# EAGLE design dtmf_v1 (EAGLE 9.6.2)
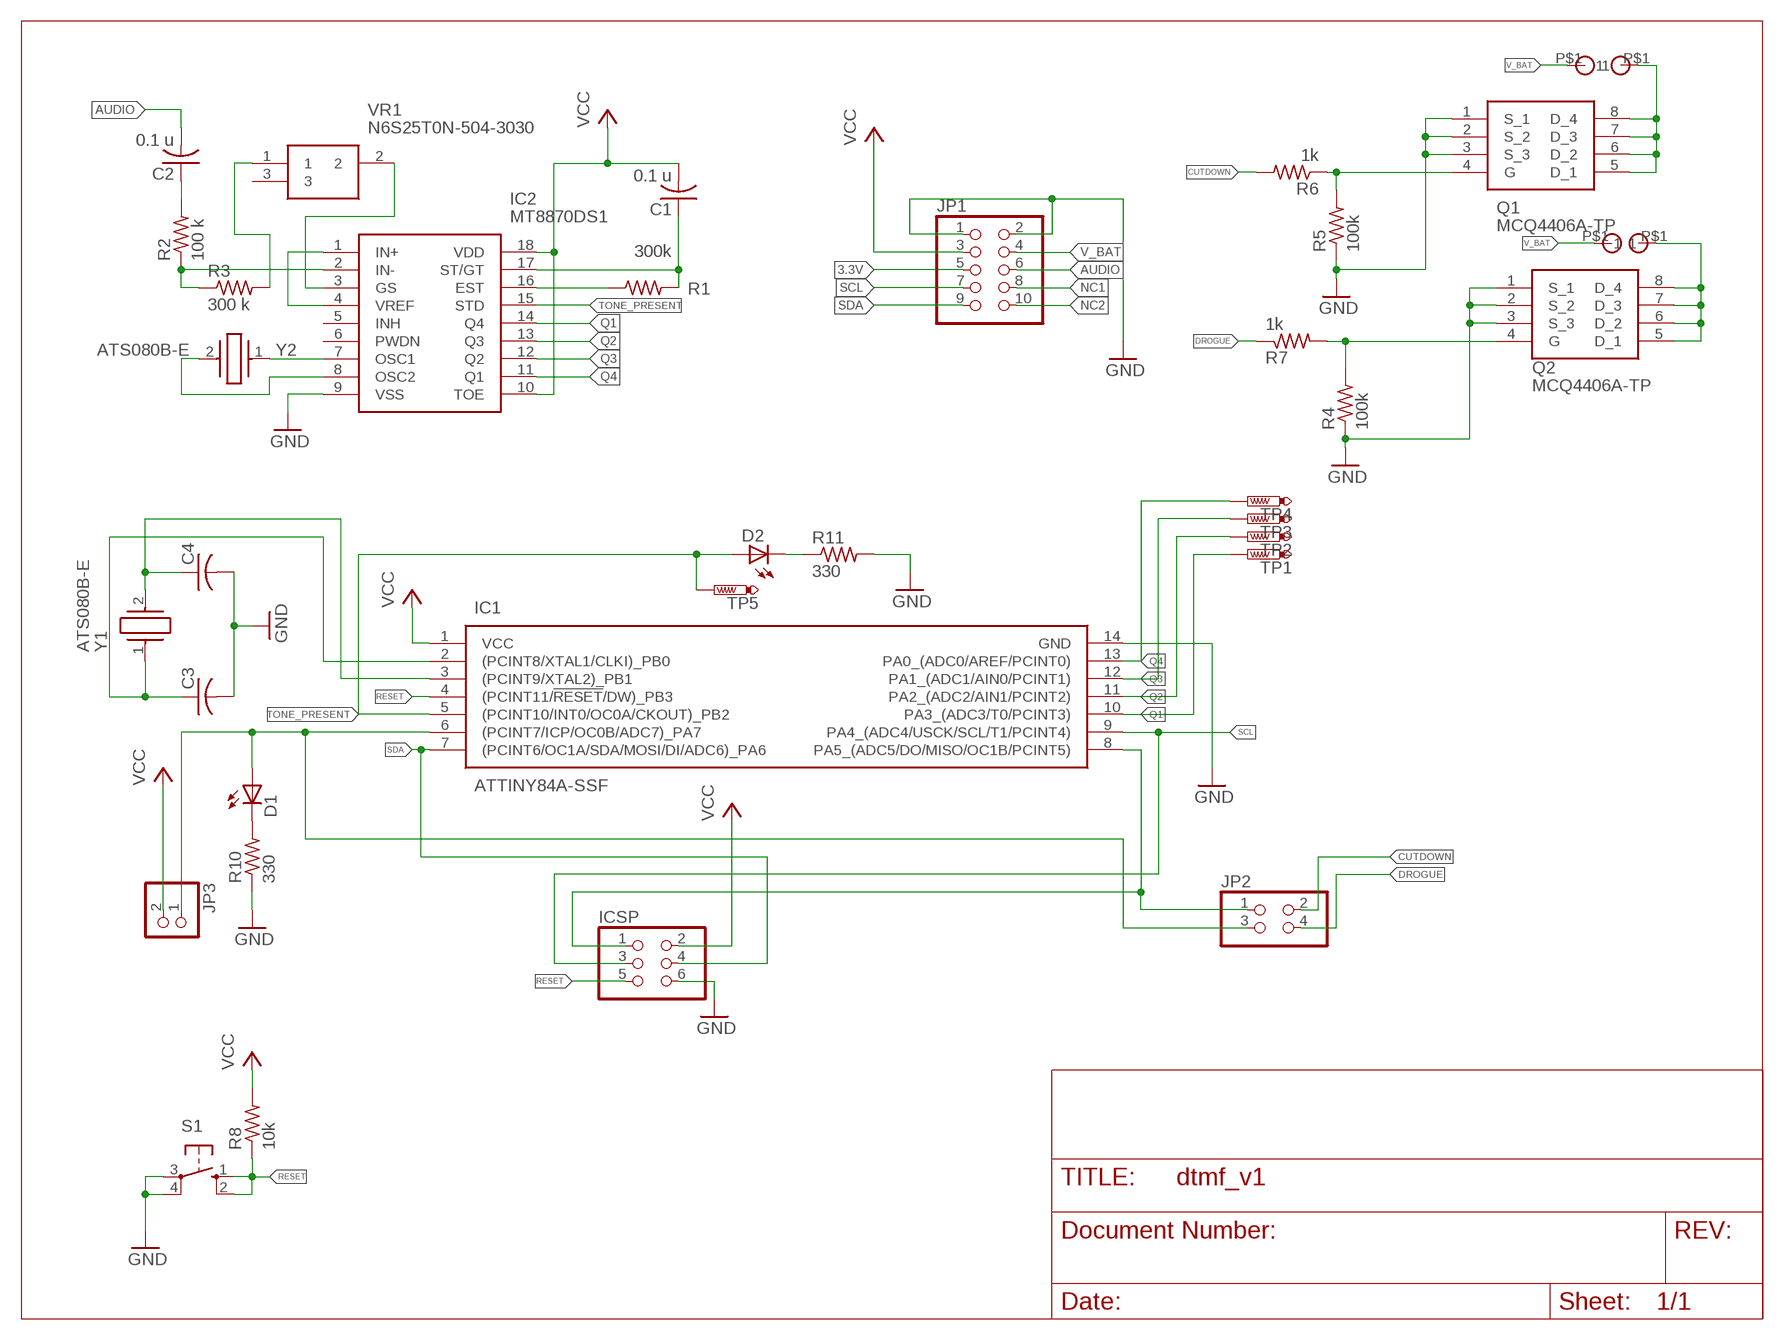
[diagram p0: schematic, sheet 1]

## Parts
C1  0.1 u  C-USC0603  [C0603]
C2  0.1 u  C-USC0603  [C0603]
C3  C-USC0805  [C0805]
C4  C-USC0805  [C0805]
D1  LEDCHIP-LED0805  [CHIP-LED0805]
D2  LEDCHIP-LED0805  [CHIP-LED0805]
IC1  ATTINY84A-SSF  [SOIC127P600X175-14N]
IC2  MT8870DS1  [SOIC127P1032X265-18N]
ICSP  PINHD-2X3  [2X03]
JP1  PINHD-2X5  [2X05]
JP2  PINHD-2X2  [2X02]
JP3  PINHD-1X2  [1X02]
Q1  MCQ4406A-TP  [SOIC127P600X175-8N]
Q2  MCQ4406A-TP  [SOIC127P600X175-8N]
R1  300k  R-US_M0805  [M0805]
R2  100 k  R-US_M0805  [M0805]
R3  300 k  R-US_M0805  [M0805]
R4  100k  R-US_M0805  [M0805]
R5  100k  R-US_M0805  [M0805]
R6  1k  R-US_M0805  [M0805]
R7  1k  R-US_M0805  [M0805]
R8  10k  R-US_0207/10  [0207/10]
R10  330  R-US_M0805  [M0805]
R11  330  R-US_M0805  [M0805]
S1  10-XX  [B3F-10XX]
TP1  PTR1B1,27  [B1,27]
TP2  PTR1B1,27  [B1,27]
TP3  PTR1B1,27  [B1,27]
TP4  PTR1B1,27  [B1,27]
TP5  PTR1B1,27  [B1,27]
U$1  M3_HOLE  [MOUNTING_PAD]
U$2  M3_HOLE  [MOUNTING_PAD]
U$3  M3_HOLE  [MOUNTING_PAD]
U$4  M3_HOLE  [MOUNTING_PAD]
VR1  N6S25T0N-504-3030  [N6S25T0N5043030]
Y1  ATS080B-E  [ATS080BE]
Y2  ATS080B-E  [ATS080BE]

## Nets
3.3V: JP1.5
AUDIO: C2.2 JP1.6
CUTDOWN: JP2.2 R6.2
DROGUE: JP2.4 R7.1
GND [PWR]: C3.2 C4.2 IC1.14(GND) IC2.9(VSS) ICSP.6 JP1.1 JP1.2 Q1.1(S_1) Q1.2(S_2) Q1.3(S_3) Q2.1(S_1) Q2.2(S_2) Q2.3(S_3) R4.1 R5.1 R10.1 R11.2 S1.3(P) S1.4(P1)
N$1: IC2.7(OSC1) Y2.1
N$2: IC2.8(OSC2) Y2.2
N$3: IC2.1(IN+) IC2.4(VREF)
N$6: Q1.4(G) R5.2 R6.1
N$9: C3.1 IC1.2((PCINT8/XTAL1/CLKI)_PB0) Y1.1
N$10: C4.1 IC1.3((PCINT9/XTAL2)_PB1) Y1.2
N$11: C1.1 IC2.17(ST/GT) R1.2
N$12: IC2.16(EST) R1.1
N$13: R3.2 VR1.1
N$14: IC2.2(IN-) R2.1 R3.1
N$15: C2.1 R2.2
N$16: IC2.3(GS) VR1.2
N$17 [PWR]: Q2.5(D_1) Q2.6(D_2) Q2.7(D_3) Q2.8(D_4) U$4.P$1
N$20 [PWR]: Q1.5(D_1) Q1.6(D_2) Q1.7(D_3) Q1.8(D_4) U$2.P$1
N$22: D1.A IC1.6((PCINT7/ICP/OC0B/ADC7)_PA7) JP2.3 JP3.1
N$23: D1.C R10.2
N$24: IC1.8(PA5_(ADC5/DO/MISO/OC1B/PCINT5)) ICSP.1 JP2.1
N$25: D2.C R11.1
N$27: Q2.4(G) R4.2 R7.2
NC1: JP1.8
NC2: JP1.10
Q1: IC1.10(PA3_(ADC3/T0/PCINT3)) IC2.14(Q4) TP1.TP
Q2: IC1.11(PA2_(ADC2/AIN1/PCINT2)) IC2.13(Q3) TP2.TP
Q3: IC1.12(PA1_(ADC1/AIN0/PCINT1)) IC2.12(Q2) TP3.TP
Q4: IC1.13(PA0_(ADC0/AREF/PCINT0)) IC2.11(Q1) TP4.TP
RESET: IC1.4((PCINT11/!RESET!/DW)_PB3) ICSP.5 R8.1 S1.1(S) S1.2(S1)
SCL: IC1.9(PA4_(ADC4/USCK/SCL/T1/PCINT4)) ICSP.3 JP1.7
SDA: IC1.7((PCINT6/OC1A/SDA/MOSI/DI/ADC6)_PA6) ICSP.4 JP1.9
TONE_PRESENT: D2.A IC1.5((PCINT10/INT0/OC0A/CKOUT)_PB2) IC2.15(STD) TP5.TP
V_BAT [PWR]: JP1.4 U$1.P$1 U$3.P$1
VCC: C1.2 IC1.1(VCC) IC2.10(TOE) IC2.18(VDD) ICSP.2 JP1.3 JP3.2 R8.2
Unconnected: IC2.5(INH) IC2.6(PWDN) VR1.3

## Library data of the parts
C1-C4 = rcl:C-US: CAPACITOR, American symbol; SPICEPREFIX: C
D1 D2 = adafruit:LED: LED OSRAM: - CHIPLED LG R971, LG N971, LY N971, LG Q971, LY Q971, LO R971, LY R971 LH N974, LH R974 LS Q976, LO Q976, LY Q976 LO Q996 - Hyper CHIPLED LW Q18S LB Q993, LB Q99A, LB R99A - SideLED LS A670, LO A670, LY A670, LG A670, LP A670 LB A673, LV A673, LT A673, LW A673 LH A674 LY A675 LS A676, LA A676, LO A676, LY A676, LW A676 LS A679, LY A679, LG A679 - Hyper Micro SIDELED® LS Y876, LA Y876, LO Y876, LY Y876 LT Y87S - SmartLED LW L88C, LW L88S LB L89C, LB L89S, LG L890 LS L89K, LO L89K, LY L89K LS L896, LA L896, LO L896, LY L896 - TOPLED LS T670, LO T670, LY T670, LG T670, LP T670 LSG T670, LSP T670, LSY T670, LOP T670, LYG T670 LG T671, LOG T671, LSG T671 LB T673, LV T673, LT T673, LW T673 LH T674 LS T676, LA T676, LO T676, LY T676, LB T676, LH T676, LSB T676, LW T676 LB T67C, LV T67C, LT T67C, LS T67K, LO T67K, LY T67K, LW E67C LS E67B, LA E67B, LO E67B, LY E67B, LB E67C, LV E67C, LT E67C LW T67C LS T679, LY T679, LG T679 LS T770, LO T770, LY T770, LG T770, LP T770 LB T773, LV T773, LT T773, LW T773 LH T774 LS E675, LA E675, LY E675, LS T675 LS T776, LA T776, LO T776, LY T776, LB T776 LHGB T686 LT T68C, LB T68C - Hyper Mini TOPLED® LB M676 - Mini TOPLED Santana® LG M470 LS M47K, LO M47K, LY M47K Source: http://www.osram.convergy.de/
IC1 = ATTINY84A-SSF:ATTINY84A-SSF: Atmel ATTINY84A-SSF, 8bit AVR Microcontroller, 20MHz, 8 kB Flash, 14-Pin SOIC Source: Datasheet <http://ww1.microchip.com/downloads/en/DeviceDoc/8183S.pdf>; DESCRIPTION: Atmel ATTINY84A-SSF, 8bit AVR Microcontroller, 20MHz, 8 kB Flash, 14-Pin SOIC; HEIGHT: 1.75mm; MANUFACTURER_NAME: Microchip; MANUFACTURER_PART_NUMBER: ATTINY84A-SSF; MOUSER_PART_NUMBER: 556-ATTINY84A-SSF; MOUSER_PRICE-STOCK: https://www.mouser.co.uk/ProductDetail/Microchip-Technology/ATTINY84A-SSF?qs=TI%2F9gtmDCEG4A0yxcpFhFg%3D%3D
IC2 = MT8870DS1:MT8870DS1: Telecom Interface ICs Pb Free DTMF RECEIVER SOIC Source: Datasheet <http://www.microsemi.com/document-portal/doc_download/127041-mt8870d-datasheet-oct2006>; DESCRIPTION: Telecom Interface ICs Pb Free DTMF RECEIVER SOIC; HEIGHT: 2.65mm; MANUFACTURER_NAME: Microsemi Corporation; MANUFACTURER_PART_NUMBER: MT8870DS1; MOUSER_PART_NUMBER: 494-MT8870DS1; MOUSER_PRICE-STOCK: https://www.mouser.co.uk/ProductDetail/Microchip-Microsemi/MT8870DS1?qs=6jAvgNDGUA8thylXPIiMbQ%3D%3D
ICSP = pinhead:PINHD-2X3: PIN HEADER
JP1 = pinhead:PINHD-2X5: PIN HEADER
JP2 = pinhead:PINHD-2X2: PIN HEADER
JP3 = pinhead:PINHD-1X2: PIN HEADER
Q1 Q2 = MCQ4406A-TP:MCQ4406A-TP: Power MOSFETS Source: Datasheet <https://www.mccsemi.com/pdf/Products/MCQ4406A(SOP-8).pdf>; DESCRIPTION: Power MOSFETS; HEIGHT: 1.75mm; MANUFACTURER_NAME: MCC; MANUFACTURER_PART_NUMBER: MCQ4406A-TP; MOUSER_PART_NUMBER: 833-MCQ4406A-TP; MOUSER_PRICE-STOCK: https://www.mouser.co.uk/ProductDetail/Micro-Commercial-Components-MCC/MCQ4406A-TP?qs=vmHwEFxEFR%252B02FVyr5VysA%3D%3D
R1-R8 R10 R11 = rcl:R-US_: RESISTOR, American symbol; SPICEPREFIX: R
S1 = switch-omron:10-XX: OMRON SWITCH; MPN: B3F-1000; OC_FARNELL: 176432; OC_NEWARK: 36M3542
TP1-TP5 = testpad:PTR1: TEST PIN
U$1-U$4 = KE8TJE:M3_HOLE
VR1 = N6S25T0N-504-3030:N6S25T0N-504-3030: TRIMMER, 500K, 0.1W, 1TURN; Trimpot Type:Single Turn; Element Material:Carbon; Adjustment Type:Side Adjust; Track Resistance:500kohm; Potentiometer Mounting:Through Hole; No. of Turns:1Turns; Product Range:N6 Series; MSL:- RoHS Compliant: Yes Source: Datasheet <https://componentsearchengine.com/Datasheets/1/N6S25T0N-504-3030.pdf>; DESCRIPTION: TRIMMER, 500K, 0.1W, 1TURN; Trimpot Type:Single Turn; Element Material:Carbon; Adjustment Type:Side Adjust; Track Resistance:500kohm; Potentiometer Mounting:Through Hole; No. of Turns:1Turns; Product Range:N6 Series; MSL:- RoHS Compliant: Yes; HEIGHT: 8.7mm; MANUFACTURER_NAME: PIHER; MANUFACTURER_PART_NUMBER: N6S25T0N-504-3030; MOUSER_PART_NUMBER: 531-N6S25T0N5043030; MOUSER_PRICE-STOCK: https://www.mouser.co.uk/ProductDetail/Amphenol-Piher/N6S25T0N-504-3030?qs=byeeYqUIh0NXJQ0IYsWUmQ%3D%3D
Y1 Y2 = ATS080B-E:ATS080B-E: Crystals 8MHz 18pF Fund. -40C +85C Source: Datasheet; DESCRIPTION: Crystals 8MHz 18pF Fund. -40C +85C; HEIGHT: 3.68mm; MANUFACTURER_NAME: CTS; MANUFACTURER_PART_NUMBER: ATS080B-E; MOUSER_PART_NUMBER: 774-ATS080B-E; MOUSER_PRICE-STOCK: https://www.mouser.co.uk/ProductDetail/CTS-Electronic-Components/ATS080B-E?qs=EyvxYzk7Sd1vYvYpN4HpEw%3D%3D

## Net classes
0 default: width 0.254 mm, clearance 0.254 mm
1 PWR: width 0.889 mm, clearance 0.254 mm

## Board
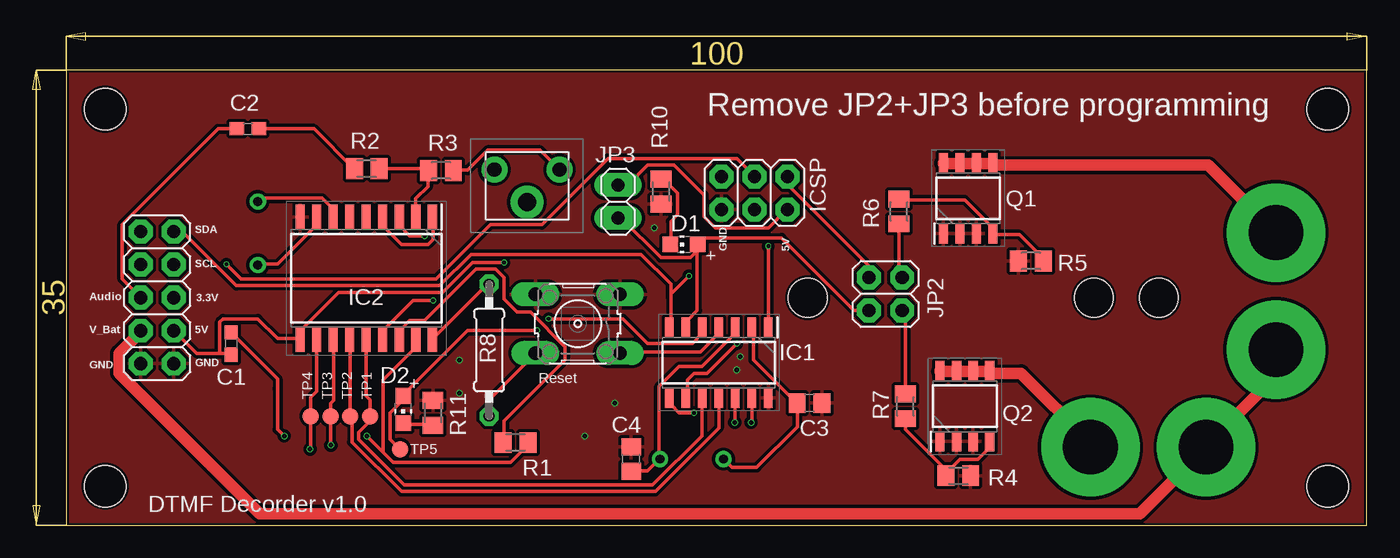
[diagram p1: board, top side]
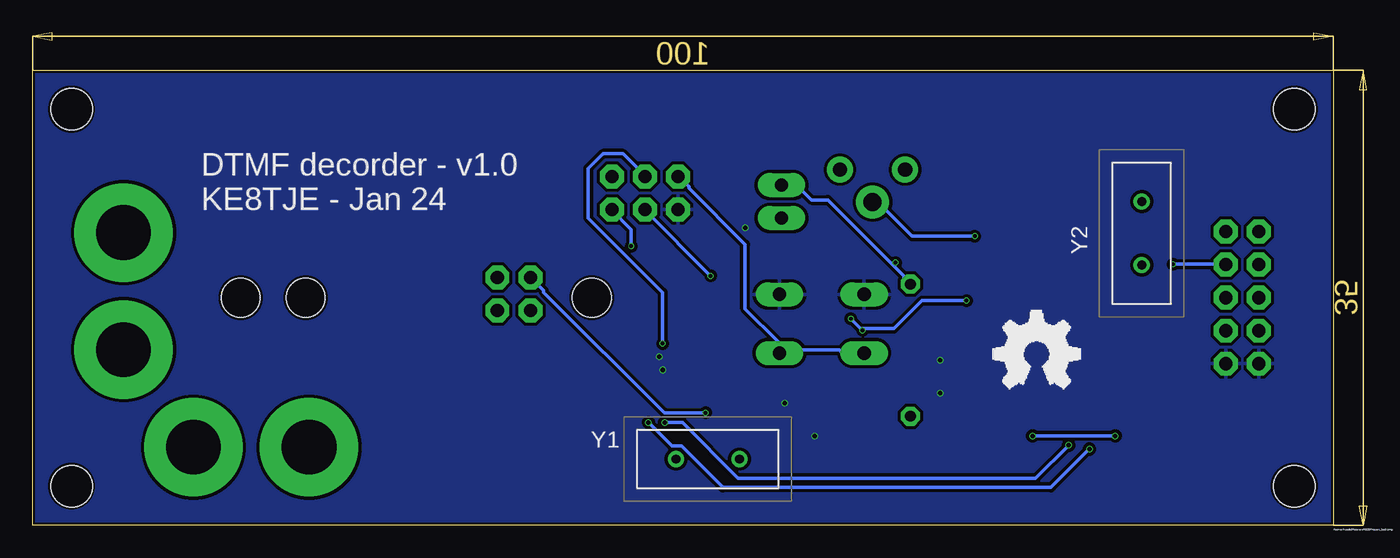
[diagram p2: board, bottom side, seen from below]

Size 100 x 35 mm. Coordinates in mm from the lower left corner, seen from the top.
Outline: 0,0 100,0 100,35 0,35 0,0
Copper layers (1*16): Top 0.035mm / dielectric 1.6mm / Bottom 0.035mm
Design rules "jlcpcb-2layers": minimum track width 5mil, minimum drill 0.3mm, track to track 5mil, track to pad 5mil, pad to pad 5mil, via to via 5mil, smd to smd 5mil, copper to edge 0.2mm, drill to drill 6mil, minimum pad ring 10mil, minimum via ring 3mil, stop-mask expansion 4mil, vias tented up to drill 0mil, thermal gap 10mil
Holes 3.2 mm at 3,3 3,32 97,32 97,3
Holes 3 mm at 57,17.5 79,17.5 84,17.5

### Footprints (pad centres in the part's own frame; a part is rotated, then mirrored left to right if it is on the bottom)
C0603 = smd 1.1 x 1: 1 -0.85,0; 2 0.85,0
C0805 = smd 1.3 x 1.5: 1 -0.95,0; 2 0.95,0
CHIP-LED0805 = smd 1.2 x 1.2: A 0,-1.05; C 0,1.05
SOIC127P600X175-14N = smd 1.528 x 0.65: 1 -2.711,3.81; 2 -2.711,2.54; 3 -2.711,1.27; 4 -2.711,0; 5 -2.711,-1.27; 6 -2.711,-2.54; 7 -2.711,-3.81; 8 2.711,-3.81; 9 2.711,-2.54; 10 2.711,-1.27; 11 2.711,0; 12 2.711,1.27; 13 2.711,2.54; 14 2.711,3.81
SOIC127P1032X265-18N = smd 1.925 x 0.7: 1 -4.712,5.08; 2 -4.712,3.81; 3 -4.712,2.54; 4 -4.712,1.27; 5 -4.712,0; 6 -4.712,-1.27; 7 -4.712,-2.54; 8 -4.712,-3.81; 9 -4.712,-5.08; 10 4.712,-5.08; 11 4.712,-3.81; 12 4.712,-2.54; 13 4.712,-1.27; 14 4.712,0; 15 4.712,1.27; 16 4.712,2.54; 17 4.712,3.81; 18 4.712,5.08
2X03 = drill 1.016 octagon: 1 -2.54,-1.27; 2 -2.54,1.27; 3 0,-1.27; 4 0,1.27; 5 2.54,-1.27; 6 2.54,1.27
2X05 = drill 1.016 octagon: 1 -5.08,-1.27; 2 -5.08,1.27; 3 -2.54,-1.27; 4 -2.54,1.27; 5 0,-1.27; 6 0,1.27; 7 2.54,-1.27; 8 2.54,1.27; 9 5.08,-1.27; 10 5.08,1.27
2X02 = drill 1.016 octagon: 1 -1.27,-1.27; 2 -1.27,1.27; 3 1.27,-1.27; 4 1.27,1.27
1X02 = drill 1.016 long: 1 -1.27,0; 2 1.27,0
SOIC127P600X175-8N = smd 1.525 x 0.7: 1 -2.712,1.905; 2 -2.712,0.635; 3 -2.712,-0.635; 4 -2.712,-1.905; 5 2.712,-1.905; 6 2.712,-0.635; 7 2.712,0.635; 8 2.712,1.905
M0805 = smd 1.3 x 1.6: 1 -0.95,0; 2 0.95,0
0207/10 = drill 0.813 octagon: 1 -5.08,0; 2 5.08,0
B3F-10XX = drill 1.016 long: 1 -3.251,2.261; 2 3.251,2.261; 3 -3.251,-2.261; 4 3.251,-2.261
B1,27 = smd 1.27 x 1.27: TP 0,0
MOUNTING_PAD = drill 4.2 pad 6.2: P$1 0,0
N6S25T0N5043030 = drill 1.1 pad 1.65: 1 0,0; 3 5,0 | drill 1.4 pad 2.1: 2 2.5,2.5
ATS080BE = drill 0.68 pad 1.247: 1 0,0; 2 4.88,0

### Placement (x,y rotation side)
C1  12.7,13.97 270 top
C2  13.97,30.48 180 top
C3  57.15,9.4 0 top
C4  43.43,5.08 90 top
D1  47.5,21.59 90 top
D2  25.91,8.89 180 top
IC1  50.18,12.5 270 top
IC2  23.07,18.99 270 top
ICSP  52.91,25.55 180 top
JP1  7,17.5 90 top
JP2  62.99,17.78 270 top
JP3  42.42,24.89 90 top
Q1  69.34,25.15 90 top
Q2  69.09,9.14 90 top
R1  34.54,6.35 0 top
R2  23.11,27.43 180 top
R3  28.81,27.28 0 top
R4  68.58,3.81 180 top
R5  74.17,20.32 0 top
R6  64.01,24.13 270 top
R7  64.52,9.14 270 top
R8  32.51,13.46 90 top
R10  45.72,25.65 90 top
R11  28.19,8.64 90 top
S1  39.32,15.49 180 top
TP1  23.37,8.38 0 top
TP2  21.84,8.38 0 top
TP3  20.32,8.38 0 top
TP4  18.8,8.38 0 top
TP5  25.65,5.84 0 top
U$1  93,13.5 0 top
U$2  93,22.5 0 top
U$3  87.63,6 0 top
U$4  78.74,6 0 top
VR1  37.93,27.35 180 top
Y1  50.53,5.09 0 bottom
Y2  14.73,24.89 270 bottom

### Tracks (layer width: path | path; a pad name or v marks a point on that pad's centre or on a via)
AUDIO
  Top 0.254: C2.2 11.68,30.48 4.32,23.11 4.32,18.92 5.71,17.53 JP1.6
CUTDOWN
  Top 0.254: R6.2 64.01,19.3 JP2.2
DROGUE
  Top 0.254: R7.1 64.52,16.26 JP2.4
GND  (via drill 0.35)
  other vias: 30.23,12.7 30.23,10.16 42.16,9.4 39.88,6.86 51.56,11.94 51.82,12.95 45.21,22.86
  pour Top: -2.54,36.32 103.12,36.32 103.12,-0.76 -2.54,-0.76
  pour Bottom: -2.03,36.07 102.62,36.07 102.62,-1.52 -2.03,-1.52
N$1
  Top 0.254: Y2.1 14.99,25.15 19.68,25.15 20.45,24.38 20.45,23.75 IC2.7
N$2
  Top 0.254: IC2.8 19.18,23.62 19.18,22.99 16.26,20.07 14.73,20.07 Y2.2
N$3
  Top 0.254: IC2.4 24.38,23.62 24.38,22.99 25.78,21.59 27.81,21.59 28.19,21.97 28.19,23.62 IC2.1
N$6
  Top 0.254: R5.2 75.06,20.32 75.06,20.57 73.28,22.35 71.25,22.35 Q1.4 71.25,22.86 69.09,25.02 64.01,25.02 R6.1
N$9
  Top 0.254: Y1.1 50.55,5.08 51.18,4.45 53.09,4.45 56.2,7.56 C3.1 56.13,9.4 52.83,12.7 52.83,15.11 IC1.2
N$10
  Top 0.254: C4.1 43.43,4.19 44.7,4.19 45.59,5.08 Y1.2 45.59,5.21 45.59,10.67 47.12,12.19 48.9,12.19 51.44,14.73 51.44,15.11 IC1.3
N$11  (via drill 0.35)
  Top 0.254: IC2.17 26.8,14.22 26.8,13.59 24.38,11.18 24.38,5.59 | 24.38,5.59 25.15,4.83 34.16,4.83 35.43,6.1 35.43,6.35 R1.2 | v16.76,6.86 16.26,7.37 16.26,10.5 16.26,11.26 C1.1 | v23.11,6.86 24.38,5.59
  Bottom 0.254: v16.76,6.86 v23.11,6.86
N$12
  Top 0.254: R1.1 33.66,6.35 33.66,8 38.35,12.7 38.35,13.72 35.69,16.38 34.67,16.38 33.66,17.4 33.66,19.05 33.02,19.68 31.5,19.68 27.56,15.75 26.42,15.75 25.65,14.99 25.65,14.35 IC2.16
N$13
  Top 0.254: R3.2 29.84,27.3 30.86,27.3 32.38,28.83 36.45,28.83 37.85,27.43 VR1.1
N$14
  Top 0.254: R2.1 27.69,27.43 27.81,27.3 | 27.81,27.3 R3.1 | 27.81,27.3 27.81,26.04 26.88,25.1 26.85,25.1 26.85,23.74 IC2.2
N$15
  Top 0.254: C2.1 19.05,30.48 22.1,27.43 R2.2
N$16  (via drill 0.3)
  Top 0.254: v27.56,22.23 26.42,22.23 25.65,22.99 25.65,23.62 IC2.3
  Bottom 0.254: v27.56,22.23 32.38,22.23 34.92,24.77 35.31,24.77 VR1.2
N$17
  Top 0.889: 68.45,11.81 67.18,11.81 Q2.8 | 68.45,11.81 Q2.7 | 68.45,11.81 69.72,11.81 | 69.72,11.81 Q2.6 | 69.72,11.81 70.99,11.81 | 70.99,11.81 Q2.5 | 70.99,11.81 71.37,11.68 73.41,11.68 78.74,6.35 U$4.P$1
N$20
  Top 0.889: 68.71,27.81 67.44,27.81 Q1.8 | 68.71,27.81 Q1.7 | 68.71,27.81 69.98,27.81 | 69.98,27.81 Q1.6 | 69.98,27.81 71.25,27.81 | 71.25,27.81 Q1.5 | 71.25,27.81 71.63,27.69 87.81,27.69 U$2.P$1
N$22
  Top 0.254: 48.51,21.08 48.51,16.51 47.75,15.75 47.75,15.24 IC1.6 | 48.51,21.08 48.51,21.59 D1.A 48.64,21.59 49.15,22.1 54.99,22.1 60.58,16.51 JP2.3 | JP3.1 42.67,23.62 45.72,20.57 48.01,20.57 48.51,21.08
N$23
  Top 0.254: D1.C 46.48,21.59 46.48,23.37 46.99,23.88 46.99,25.53 45.97,26.54 45.72,26.54 R10.2
N$24  (via drill 0.3)
  Top 0.254: v48.26,8.64 47.12,8.64 46.48,9.27 46.48,9.78 IC1.8 | JP2.1 61.72,19.94 55.5,26.16 55.5,26.8 ICSP.1
  Bottom 0.254: v48.26,8.64 51.44,8.64 60.71,17.91 60.71,18.03 JP2.1
N$25
  Top 0.254: D2.C 25.91,7.75 28.19,7.75 R11.1
N$27
  Top 0.254: Q2.4 70.99,5.97 70.1,5.08 68.71,5.08 67.69,4.06 67.69,3.81 R4.2 67.69,4.19 64.52,7.37 R7.2
Q1
  Top 0.254: IC2.14 23.07,9.93 23.37,9.63 TP1.TP 23.37,8.01 22.48,7.12 22.48,6.6 25.98,3.1 45.09,3.1 48.87,6.88 48.87,9.75 IC1.10
Q2
  Top 0.254: IC2.13 21.84,14.24 TP2.TP 21.97,8.25 21.97,6.39 25.77,2.59 45.3,2.59 49.9,7.2 50.18,7.47 IC1.11
Q3  (via drill 0.35)
  Top 0.254: IC2.12 20.57,14.24 20.57,9.6 20.32,9.35 TP3.TP 20.32,6.18 v20.35,6.15 | v51.4,7.9 51.4,9.74 IC1.12
  Bottom 0.254: v20.35,6.15 22.9,3.6 45.75,3.6 50.05,7.9 v51.4,7.9
Q4  (via drill 0.35)
  Top 0.254: IC1.13 52.7,9.78 52.72,9.77 52.72,7.97 v52.65,7.9 | IC2.11 19.26,10.29 18.8,9.83 TP4.TP 18.8,5.9 v18.75,5.85
  Bottom 0.254: v18.75,5.85 21.7,2.9 46.93,2.9 50.12,6.09 50.84,6.09 v52.65,7.9
RESET
  Top 0.254: R8.1 32.51,9.65 36.07,13.21 S1.2 | IC1.4 50.16,15.11 50.16,14.73 48.77,13.34 42.67,13.34 S1.1
  Bottom 0.254: ICSP.5 50.29,26.8 49.53,26.04 49.53,25.91 45.21,21.59 45.21,16.64 42.67,14.1 42.67,13.34 S1.1 42.55,13.34 40.89,13.34 40.77,13.46 37.97,13.46 37.85,13.34 36.2,13.34 S1.2
SCL  (via drill 0.3)
  Top 0.254: v51.56,13.97 49.28,11.68 48.26,11.68 47.75,11.18 47.75,9.91 IC1.9 | v12.32,20.07 13.46,18.92 28.45,18.92 32.64,23.11 36.58,23.11 41.66,28.19 51.56,28.19 52.83,26.92 ICSP.3
  Bottom 0.254: v51.56,13.97 51.56,17.91 57.28,23.62 57.28,27.43 56.13,28.57 54.61,28.57 52.96,26.92 ICSP.3 | v12.32,20.07 8.38,20.07 JP1.7
SDA  (via drill 0.3)
  Top 0.254: 46.48,17.78 46.48,17.53 46.48,15.24 IC1.7 | v47.88,19.18 46.48,17.78 | JP1.9 8.38,22.48 9.02,22.48 13.08,18.41 28.7,18.41 31.11,20.83 43.43,20.83 43.56,20.83 44.2,20.83 46.48,18.54 46.48,17.78
  Bottom 0.254: v47.88,19.18 52.96,24.26 ICSP.4
TONE_PRESENT  (via drill 0.3)
  Top 0.254: TP5.TP 24.89,6.6 24.89,8.64 25.91,9.65 D2.A 25.91,10.03 30.86,14.99 v36.2,14.99 | v37.08,15.88 42.8,15.88 44.7,13.97 48.13,13.97 48.9,14.73 48.9,15.11 IC1.5 | v28.19,17.27 26.67,17.27 24.38,14.99 24.38,14.35 IC2.15
  Bottom 0.254: v37.08,15.88 v36.2,14.99 36.2,15.11 33.78,15.11 31.62,17.27 v28.19,17.27
V_BAT
  Top 0.889: JP1.4 5.71,14.86 4.06,13.21 4.06,11.68 14.86,0.89 82.55,0.89 87.63,5.97 U$3.P$1 87.88,6.35 93,11.47 U$1.P$1
VCC  (via drill 0.3)
  Top 0.254: 11.81,13.21 10.03,13.21 8.38,14.86 JP1.3 | 11.81,13.21 12.7,13.21 C1.2 | 11.81,13.21 11.81,15.62 12.06,15.88 14.73,15.88 16.26,14.35 17.91,14.35 IC2.10 17.91,14.48 17.91,14.86 20.95,17.91 28.96,17.91 31.24,20.19 v33.66,20.19 | R8.2 32.38,18.54 28.19,14.35 IC2.18 | v53.98,21.46 53.98,15.24 IC1.1 | JP3.2 43.18,26.16 44.7,27.69 46.74,27.69 49.02,25.4 49.02,23.75 49.91,22.86 53.98,22.86 55.37,24.26 ICSP.2
  Bottom 0.254: v53.98,21.46 53.98,22.73 55.5,24.26 ICSP.2 | R8.2 33.02,19.05 33.02,19.18 33.85,20 | 33.85,20 38.86,25.02 40.13,25.02 41.27,26.16 JP3.2 | 33.85,20 v33.66,20.19

### Text on the board
tPlace: SDA | GND | 5V | SCL | Audio | 3.3V | V_Bat | 5V | GND | GND | Reset | DTMF Decorder v1.0
bPlace: /home/hasith/Pictures/NEBP/open_hw2.bmp | /home/hasith/Pictures/NEBP/open_hw3.bmp
tNames: Remove JP2+JP3 before programming
bNames: DTMF decorder - v1.0 / KE8TJE - Jan 24